# EAGLE design simmodule_adapter_v2.0.1_nov2023 (EAGLE 9.6.2)
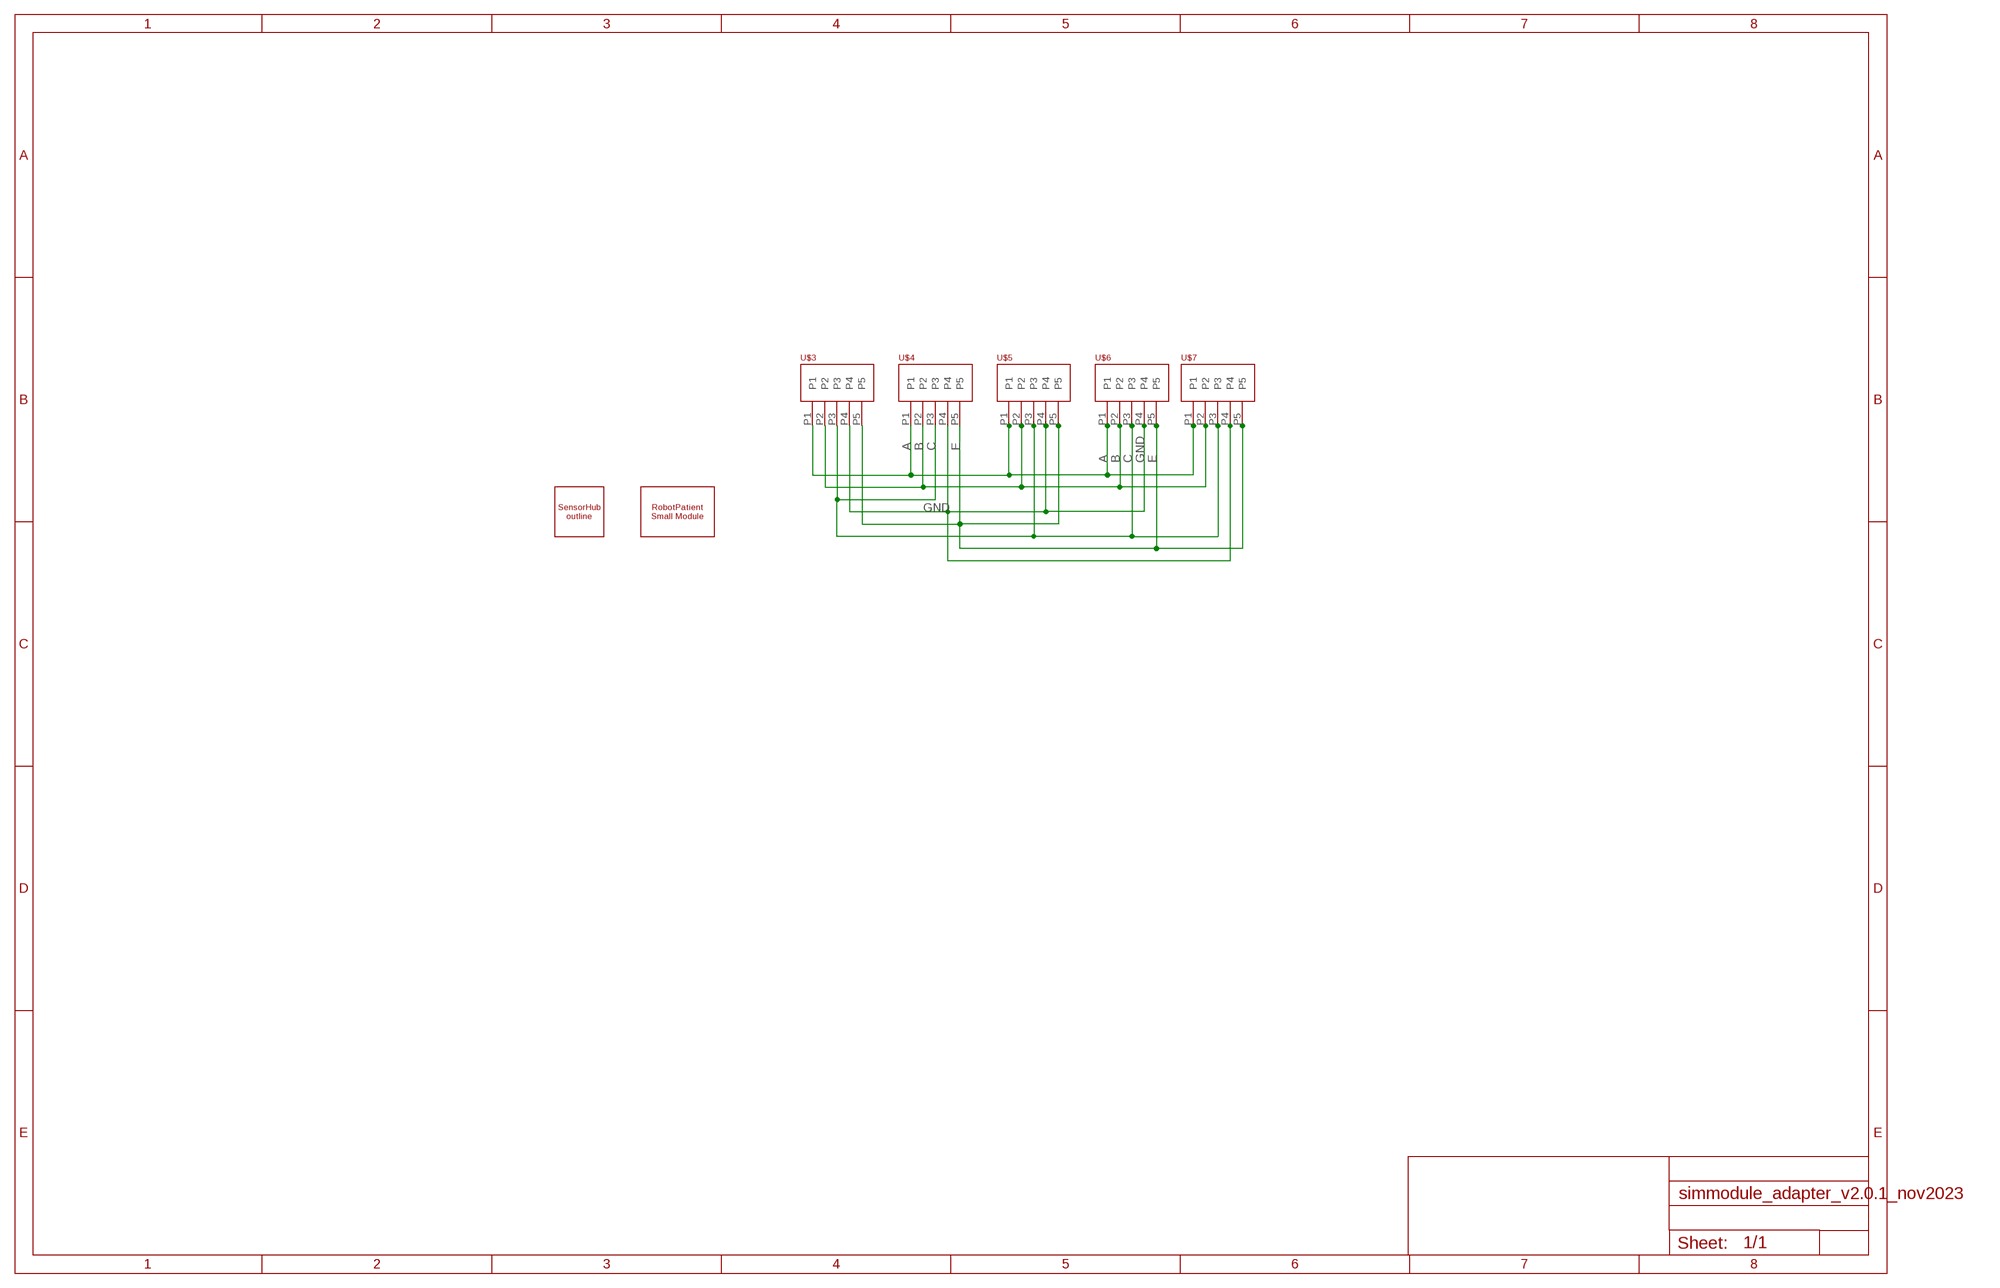
[diagram p0: schematic, sheet 1]

## Parts
U$1  SENSORHUB_PROFILEBOARD  [SENSORHUB_OUTLINE]
U$2  ROBOTPATIENT_SMALL_MODULEOUTLINE  [ROBOTPATIENT_SMALL]
U$3  PHOENIX_PTSM_M5_NEUTRAL  [PTSM_M5_TH_NEUTRAL]
U$4  PHOENIX_PTSM_M5_NEUTRAL  [PTSM_M5_TH_NEUTRAL]
U$5  PHOENIX_PTSM_M5_NEUTRAL  [PTSM_M5_TH_NEUTRAL]
U$6  PHOENIX_PTSM_M5_NEUTRAL  [PTSM_M5_TH_NEUTRAL]
U$7  PHOENIX_PTSM_M5_NEUTRAL  [PTSM_M5_TH_NEUTRAL]

## Nets
A: U$3.P1 U$4.P1 U$5.P1 U$6.P1 U$7.P1
B: U$3.P2 U$4.P2 U$5.P2 U$6.P2 U$7.P2
C: U$3.P3 U$4.P3 U$5.P3 U$6.P3 U$7.P3
E: U$3.P5 U$4.P5 U$5.P5 U$6.P5 U$7.P5
GND: U$3.P4 U$4.P4 U$5.P4 U$6.P4 U$7.P4

## Library data of the parts
U$1 = jk_customs:SENSORHUB_PROFILE
U$2 = jk_customs:ROBOTPATIENT_SMALL_MODULE
U$3-U$7 = jk_customs:PHOENIX_PTSM_M5_NEUTRAL

## Board
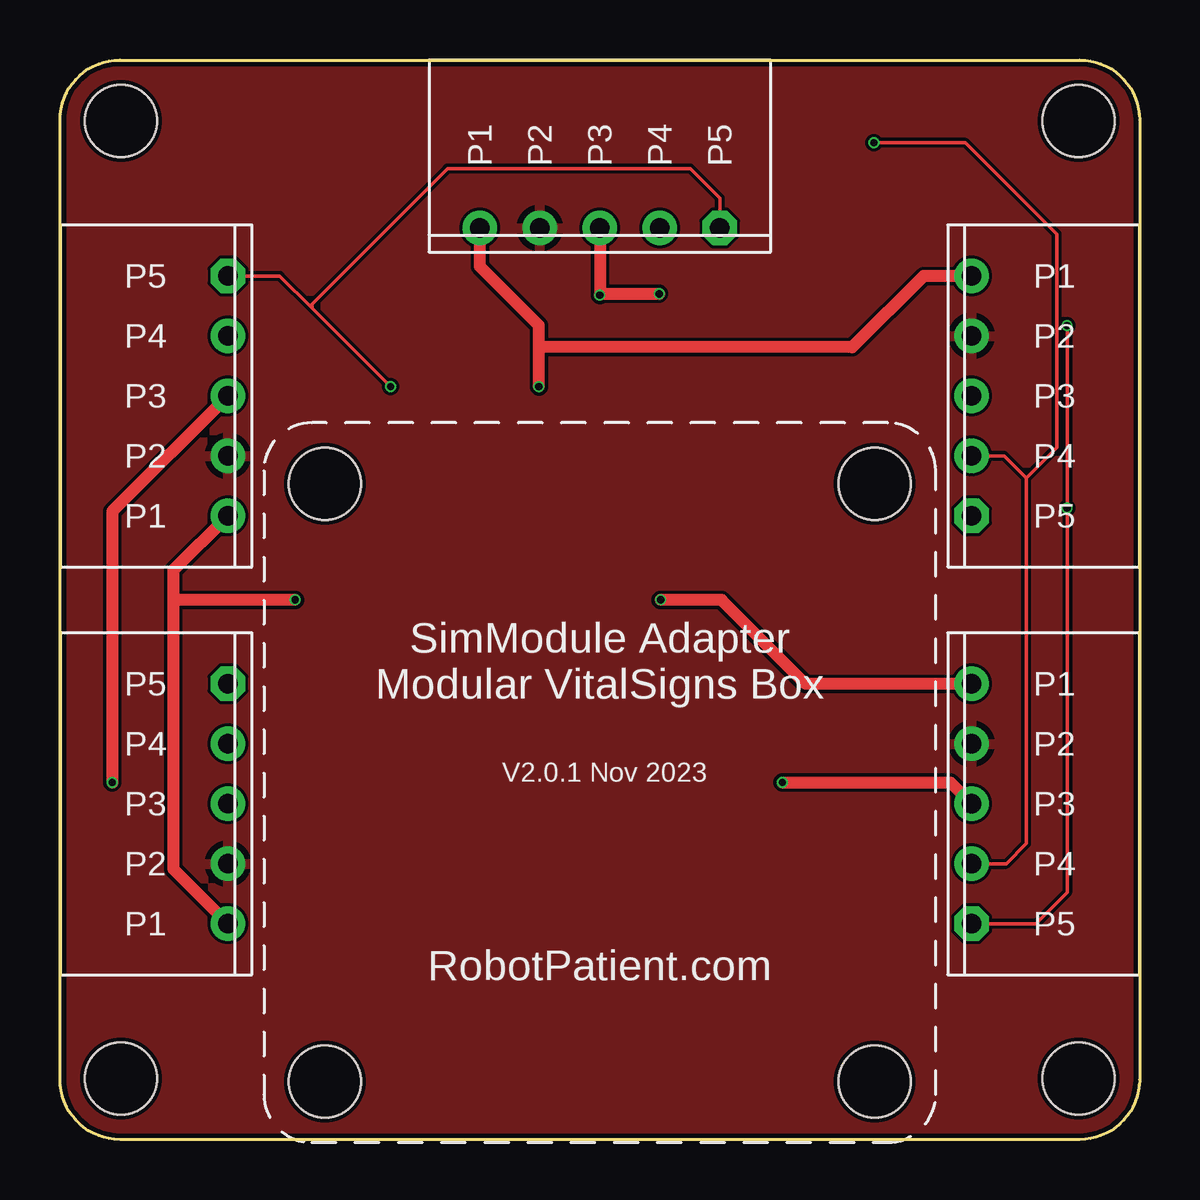
[diagram p1: board, top side]
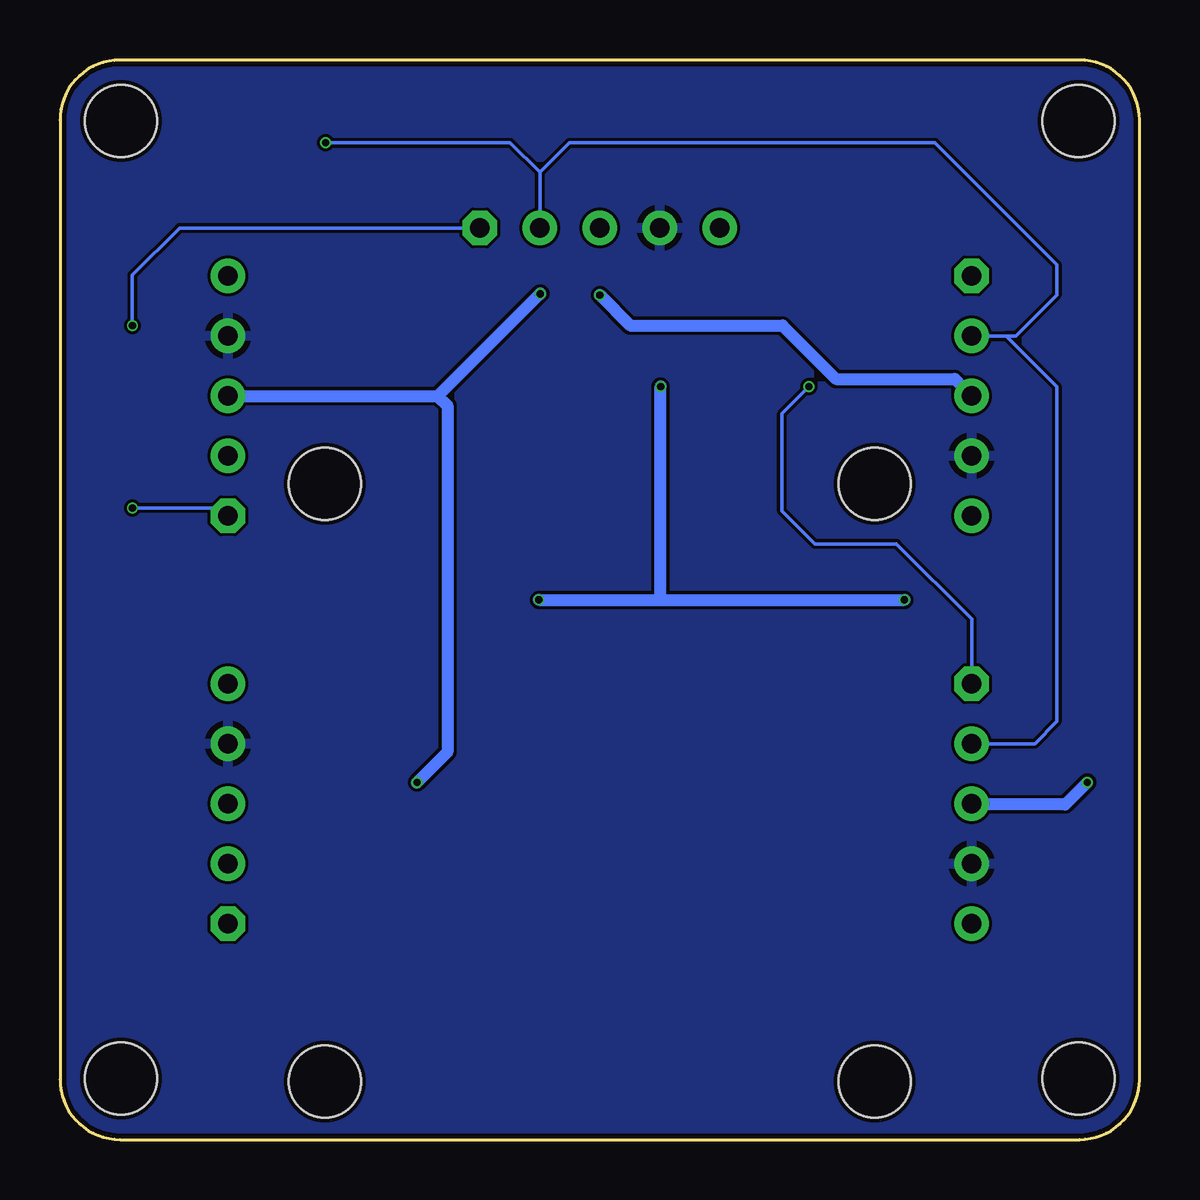
[diagram p2: board, bottom side, seen from below]

Size 45 x 45 mm. Coordinates in mm from the lower left corner, seen from the top.
Copper layers (1*16): Top 0.035mm / dielectric 1.6mm / Bottom 0.035mm
Design rules "jlcpcb-2layers_2023": minimum track width 5mil, minimum drill 0.3mm, track to track 5mil, track to pad 5mil, pad to pad 5mil, via to via 5mil, smd to smd 5mil, copper to edge 0.2mm, drill to drill 6mil, minimum pad ring 10mil, minimum via ring 3mil, stop-mask expansion 4mil, vias tented up to drill 20mil, thermal gap 10mil

### Footprints (pad centres in the part's own frame; a part is rotated, then mirrored left to right if it is on the bottom)
SENSORHUB_OUTLINE = hole 3: -19.96,19.96; 19.96,19.96; -19.96,-19.96; 19.96,-19.96
ROBOTPATIENT_SMALL = hole 3: -11.455,12.455; 11.455,12.455; 11.455,-12.455; -11.455,-12.455
PTSM_M5_TH_NEUTRAL = drill 0.8 octagon: P1 5,1 | drill 0.8: P2 2.5,1; P3 0,1; P4 -2.5,1; P5 -5,1

### Placement (x,y rotation side)
U$1  22.5,22.5 0 top
U$2  22.5,14.88 0 top
U$3  8,31 90 top
U$4  8,14 90 top
U$5  37,14 270 top
U$6  37,31 270 top
U$7  22.5,37 0 top

### Tracks (layer width: path | path; a pad name or v marks a point on that pad's centre or on a via)
A  (via drill 0.3)
  Top 0.152: v41.98,33.93 v41.98,26.32 41.98,10.29 40.67,8.99 38.01,8.99 U$5.P1 | v13.78,31.39 10.51,34.66 | 10.51,34.66 9.16,36 U$3.P1 | U$7.P1 27.5,39.24 26.27,40.47 16.15,40.47 10.51,34.83 10.51,34.66
  Bottom 0.152: U$7.P1 40.02,38 41.98,36.04 v41.98,33.93 | U$6.P1 38.32,26.32 v41.98,26.32 | U$4.P1 7,21.69 10.13,24.82 13.53,24.82 14.91,26.2 14.91,30.26 v13.78,31.39
B  (via drill 0.3)
  Top 0.152: U$5.P2 39.44,11.5 40.28,12.34 40.28,27.58 | 40.28,27.58 39.36,28.5 U$6.P2 | 40.28,27.58 41.55,28.85 41.55,37.74 37.74,41.55 v33.93,41.55
  Bottom 0.152: U$3.P2 5.56,33.5 | 5.56,33.5 3.45,31.39 3.45,17.42 4.37,16.5 U$4.P2 | U$7.P2 25,40.32 | 25,40.32 23.77,41.55 8.53,41.55 3.45,36.47 3.45,35.2 5.15,33.5 5.56,33.5 | 25,40.32 26.23,41.55 v33.93,41.55
C  (via drill 0.3)
  Top 0.508: U$7.P3 v22.5,35.2 22.55,35.25 v24.98,35.25 | v30.12,14.88 37.12,14.88 U$5.P3 | U$3.P3 2.18,26.18 v2.18,14.88
  Bottom 0.508: v22.5,35.2 21.23,33.93 14.88,33.93 12.65,31.7 7.7,31.7 U$3.P3 | U$6.P3 29.25,31 | 29.25,31 24.99,35.27 v24.98,35.25 | 29.25,31 28.85,30.6 28.85,16.15 v30.12,14.88 | v2.18,14.88 3.09,13.97 6.97,13.97 U$4.P3
E  (via drill 0.3)
  Top 0.508: U$3.P5 4.72,23.72 4.72,22.5 | U$4.P5 4.72,11.28 4.72,22.5 | U$6.P5 36,36 33.03,33.03 19.96,33.03 | U$7.P5 17.5,36.39 19.96,33.93 19.96,33.03 | U$5.P5 31.08,19 27.58,22.5 v25.04,22.5 | v9.8,22.5 4.72,22.5 | v19.96,31.39 19.96,33.03
  Bottom 0.508: v25.04,22.5 19.96,22.5 | 19.96,22.5 v9.8,22.5 | 19.96,22.5 v19.96,31.39
GND
  pour Top: -2.71,110.16 -2.71,-4.21 49.36,-4.21 49.36,113.06
  pour Bottom: -3.98,110.02 -3.98,-8.02 49.36,-8.02 49.36,112.98

### Text on the board
_tsilk: SimModule Adapter / Modular VitalSigns Box | RobotPatient.com